# EAGLE design ASD2431 (EAGLE 6.3)
DATABASE: ./../../../../../Components/TinyCircuits_Part_Database.txt
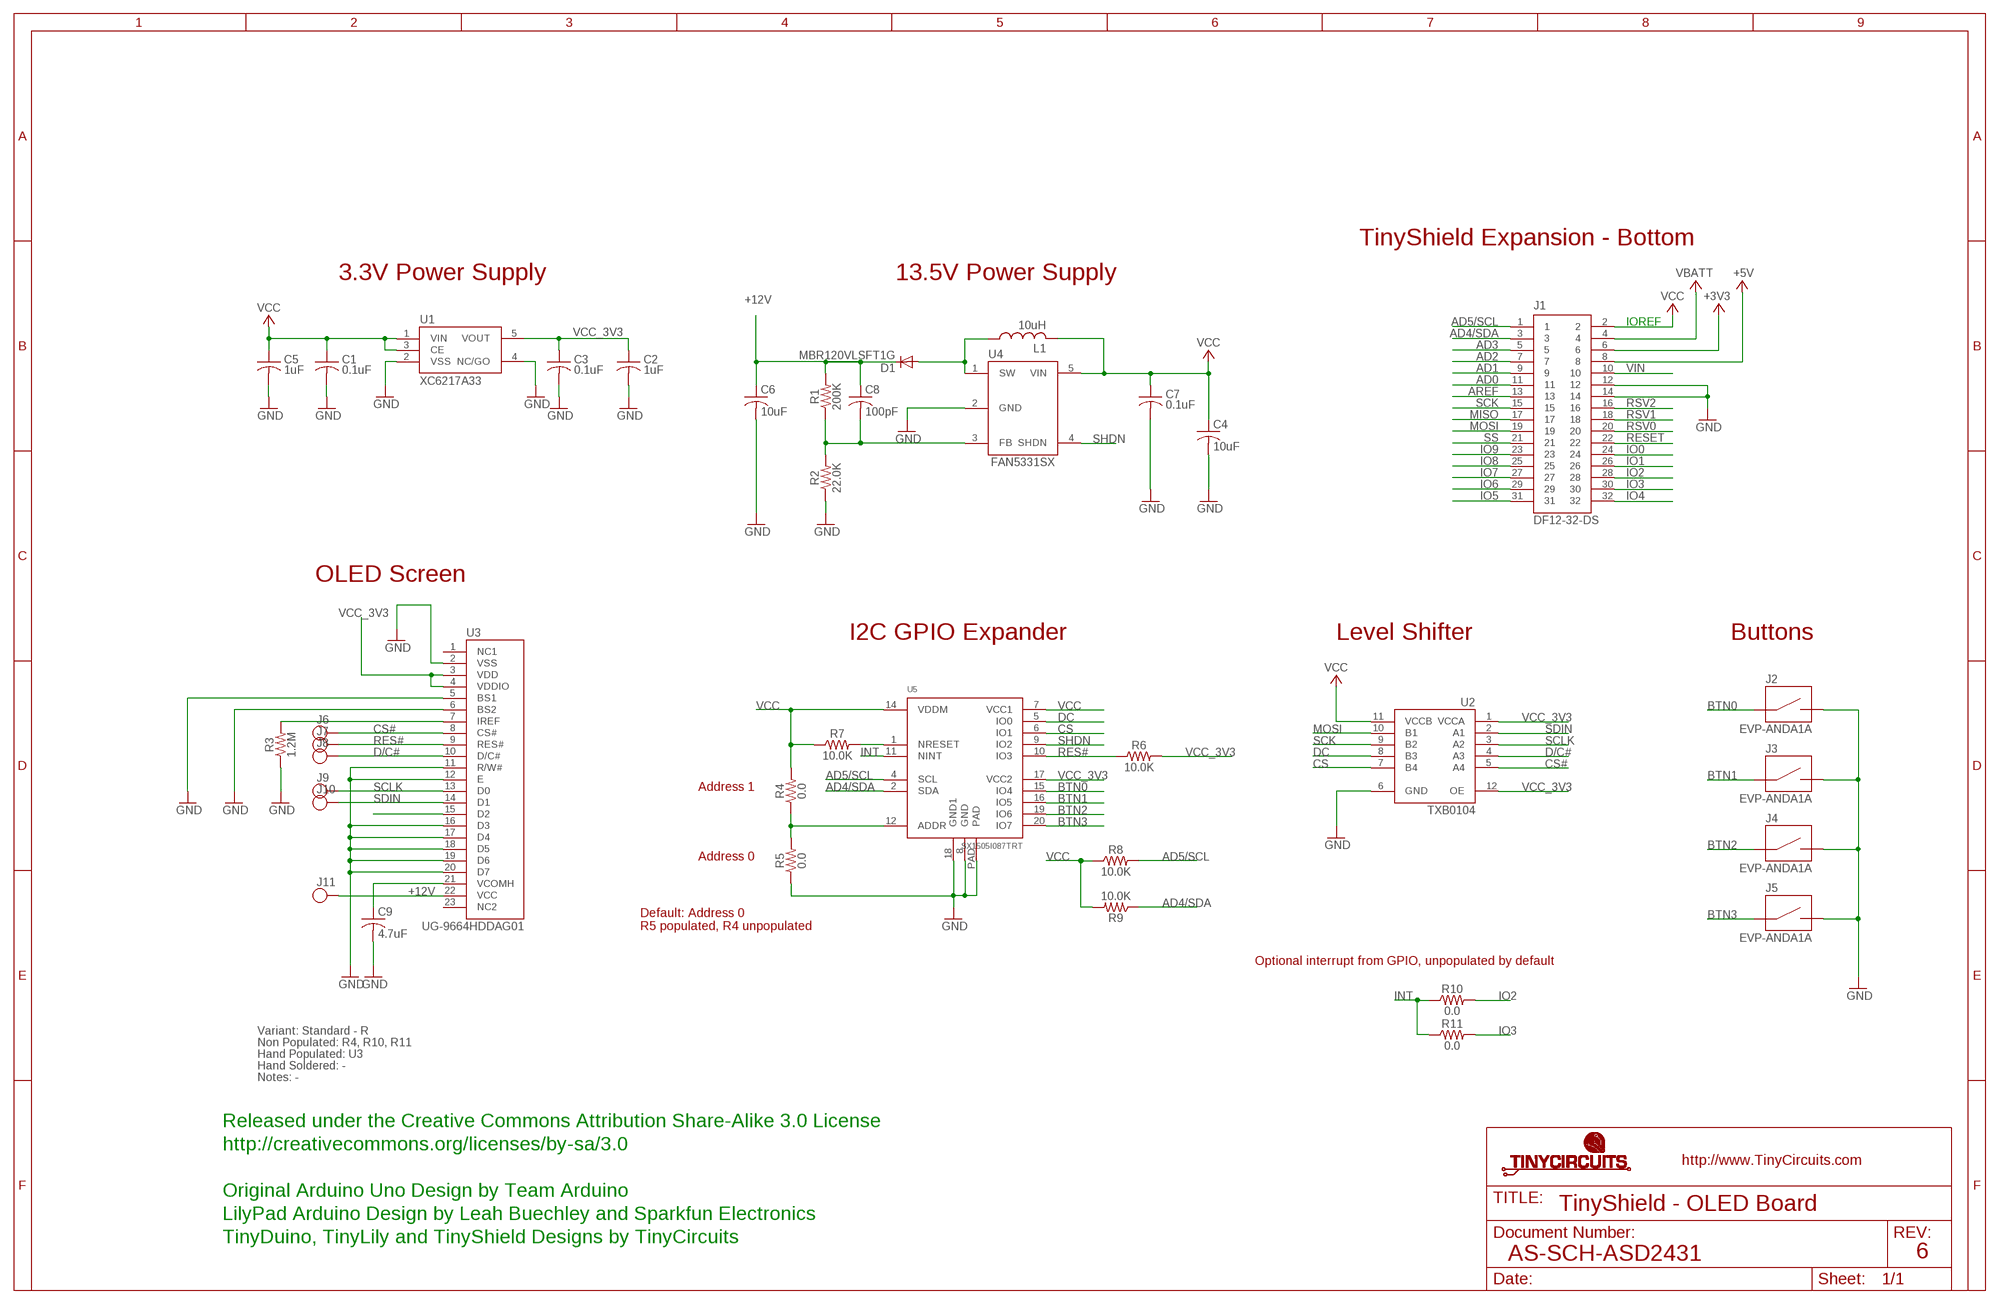
[diagram p0: schematic, sheet 1]

## Parts
C1  0.1uF  AS-ITM-00008  [C0402]
C2  1uF  AS-ITM-00105  [C0402]
C3  0.1uF  AS-ITM-00008  [C0402]
C4  10uF  AS-ITM-00045  [C0805]
C5  1uF  AS-ITM-00105  [C0402]
C6  10uF  AS-ITM-00045  [C0805]
C7  0.1uF  AS-ITM-00008  [C0402]
C8  100pF  AS-ITM-00148  [0402]
C9  4.7uF  AS-ITM-00232  [1206_CAP_TANT]
D1  MBR120VLSFT1G  AS-ITM-00111  [SOD-123FL]
J1  DF12-32-DS  AS-ITM-00012  [DF12-32-DS]
J2  EVP-ANDA1A  AS-ITM-00236  [PTS840GKP]
J3  EVP-ANDA1A  AS-ITM-00236  [PTS840GKP]
J4  EVP-ANDA1A  AS-ITM-00236  [PTS840GKP]
J5  EVP-ANDA1A  AS-ITM-00236  [PTS840GKP]
J6  TEST_POINT  [TEST_POINT_1MM]
J7  TEST_POINT  [TEST_POINT_1MM]
J8  TEST_POINT  [TEST_POINT_1MM]
J9  TEST_POINT  [TEST_POINT_1MM]
J10  TEST_POINT  [TEST_POINT_1MM]
J11  TEST_POINT  [TEST_POINT_1MM]
L1  10uH  AS-ITM-00165  [R0805]
R1  200K  AS-ITM-00178  [0402]
R2  22.0K  AS-ITM-00147  [0402]
R3  1.2M  AS-ITM-00280  [0402]
R4  0.0  AS-ITM-00076  [0402]
R5  0.0  AS-ITM-00076  [0402]
R6  10.0K  AS-ITM-00032  [0402]
R7  10.0K  AS-ITM-00032  [0402]
R8  10.0K  AS-ITM-00032  [0402]
R9  10.0K  AS-ITM-00032  [0402]
R10  0.0  AS-ITM-00076  [0402]
R11  0.0  AS-ITM-00076  [0402]
U1  XC6217A33  AS-ITM-00249  [SOT-25]
U2  TXB0104  AS-ITM-00048  [UQFN-12]
U3  UG-9664HDDAG01  AS-ITM-00158  [OLED_DISPLAY]
U4  FAN5331SX  AS-ITM-00163  [SOT-23]
U5  SX1505I087TRT  AS-ITM-00203  [QFN-UT20]

## Nets
+3V3: J1.6
+5V: J1.8
+12V: C6.1 C8.1 D1.C J11.P$1 R1.2 U3.22(VCC)
AD0: J1.11
AD1: J1.9
AD2: J1.7
AD3: J1.5
AD4/SDA: J1.3 R9.1 U5.2(SDA)
AD5/SCL: J1.1 R8.2 U5.4(SCL)
AREF: J1.13
BTN0: J2.1 J2.2 U5.15(IO4)
BTN1: J3.1 J3.2 U5.16(IO5)
BTN2: J4.1 J4.2 U5.19(IO6)
BTN3: J5.1 J5.2 U5.20(IO7)
CS: U2.7(B4) U5.6(IO1)
CS#: J6.P$1 U2.5(A4) U3.8(CS#)
D/C#: J8.P$1 U2.4(A3) U3.10(D/C#)
DC: U2.8(B3) U5.5(IO0)
GND: C1.2 C2.2 C3.2 C4.2 C5.2 C6.2 C7.2 C9.2 J1.12 J1.14 J2.3 J2.4 J3.3 J3.4 J4.3 J4.4 J5.3 J5.4 R2.1 R3.1 R5.1 U1.2(VSS) U1.4(NC/GO) U2.6(GND) U3.2(VSS) U3.5(BS1) U3.6(BS2) U3.11(R/W#) U3.12(E) U3.16(D3) U3.17(D4) U3.18(D5) U3.19(D6) U3.20(D7) U4.2(GND) U5.8(GND) U5.18(GND1) U5.PAD
INT: R10.1 R11.1 U5.11(NINT)
IO0: J1.24
IO1: J1.26
IO2: J1.28 R10.2
IO3: J1.30 R11.2
IO4: J1.32
IO5: J1.31
IO6: J1.29
IO7: J1.27
IO8: J1.25
IO9: J1.23
MISO: J1.17
MOSI: J1.19 U2.10(B1)
N$1: R7.2 U5.1(NRESET)
N$2: D1.A L1.1 U4.1(SW)
N$3: C8.2 R1.1 R2.2 U4.3(FB)
N$6: R3.2 U3.7(IREF)
N$7: C9.1 U3.21(VCOMH)
N$13: R4.1 R5.2 U5.12(ADDR)
N$15: U3.15(D2)
RES#: J7.P$1 R6.1 U3.9(RES#) U5.10(IO3)
RESET: J1.22
RSV0: J1.20
RSV1: J1.18
RSV2: J1.16
SCK: J1.15 U2.9(B2)
SCLK: J9.P$1 U2.3(A2) U3.13(D0)
SDIN: J10.P$1 U2.2(A1) U3.14(D1)
SHDN: U4.4(SHDN) U5.9(IO2)
SS: J1.21
VBATT: J1.4
VCC: C1.1 C4.1 C5.1 C7.1 J1.2 L1.2 R4.2 R7.1 R8.1 R9.2 U1.1(VIN) U1.3(CE) U2.11(VCCB) U4.5(VIN) U5.7(VCC1) U5.14(VDDM)
VCC_3V3: C2.1 C3.1 R6.2 U1.5(VOUT) U2.1(VCCA) U2.12(OE) U3.3(VDD) U3.4(VDDIO) U5.17(VCC2)
VIN: J1.10
Unconnected: U3.1(NC1) U3.23(NC2)

## Notes on the sheet
- TinyShield Expansion - Bottom
- 3.3V Power Supply | 13.5V Power Supply
- IOREF
- OLED Screen
- I2C GPIO Expander | Level Shifter | Buttons
- Address 1
- Address 0
- Default: Address 0
  R5 populated, R4 unpopulated
- Optional interrupt from GPIO, unpopulated by default
- Variant: Standard - R
- Non Populated: R4, R10, R11
- Hand Populated: U3
- Hand Soldered: -
- Notes: -
- Released under the Creative Commons Attribution Share-Alike 3.0 License
- http://creativecommons.org/licenses/by-sa/3.0
- Original Arduino Uno Design by Team Arduino
- TinyShield - OLED Board
- LilyPad Arduino Design by Leah Buechley and Sparkfun Electronics
- TinyDuino, TinyLily and TinyShield Designs by TinyCircuits
- AS-SCH-ASD2431 | 6

## Library data of the parts
C1 C3 C7 = tinycircuits:AS-ITM-00008: CAP CER 0.1UF 16V 10% X5R 0402; PARTNO: AS-ITM-00008
C2 C5 = tinycircuits:AS-ITM-00105: CAP CER 1UF 6.3V 10% X5R 0402; PARTNO: AS-ITM-00105
C4 C6 = tinycircuits:AS-ITM-00045: CAP CER 16UF 16V 20% X5R 0805; PARTNO: AS-ITM-00045
C8 = tinycircuits:AS-ITM-00148: CAP CER 100PF 50V 5% NPO 0402; PARTNO: AS-ITM-00148
C9 = tinycircuits:AS-ITM-00232: CAP TANT 4.7UF 20V 20% 1206; PARTNO: AS-ITM-00232; PNPROTATION: 180; VALUE: F931D475MAA
D1 = tinycircuits:AS-ITM-00111: DIODE SCHOTTKY 20V 1A SOD123L; PARTNO: AS-ITM-00111; PNPROTATION: 0
J1 = tinycircuits:AS-ITM-00012: CONN RECEPT 32POS 3MM SMD 0.5MM; PARTNO: AS-ITM-00012
J2-J5 = tinycircuits:AS-ITM-00236: SWITCH TACTILE SPST-NO 0.05A 12V; PARTNO: AS-ITM-00236; PNPROTATION: 90; VALUE: PTS840 GKP
J6-J11 = tinycircuits:TEST_POINT: Test point, no drill
L1 = tinycircuits:AS-ITM-00165: INDUCTOR MULTILAYER 10UH 0805; PARTNO: AS-ITM-00165
R1 = tinycircuits:AS-ITM-00178: RES 200K OHM 116W 1% 0402 SMD; PARTNO: AS-ITM-00178
R2 = tinycircuits:AS-ITM-00147: RES 22K OHM 1/16W 5% 0402 SMD; PARTNO: AS-ITM-00147; VALUE: 22K
R3 = tinycircuits:AS-ITM-00280: RES SMD 1.2M OHM 1% 1/16W 0402; PARTNO: AS-ITM-00280
R4 R5 R10 R11 = tinycircuits:AS-ITM-00076: RES 0.0 OHM 1/16W 1% 0402 SMD; PARTNO: AS-ITM-00076
R6-R9 = tinycircuits:AS-ITM-00032: RES 10.0K OHM 1/16W 1% 0402 SMD; PARTNO: AS-ITM-00032
U1 = tinycircuits:AS-ITM-00249: IC REG LDO 3.3V 0.2A SOT25; PARTNO: AS-ITM-00249; PNPROTATION: 270
U2 = tinycircuits:AS-ITM-00048: IC VOLT-LEVEL TRANSLATOR 12UQFN; PARTNO: AS-ITM-00048; PNPROTATION: 0
U3 = tinycircuits:AS-ITM-00158: 0.96" OLED Display; PARTNO: AS-ITM-00158
U4 = tinycircuits:AS-ITM-00163: IC LED DRVR WHITE BCKLGT SOT23-5; PARTNO: AS-ITM-00163
U5 = tinycircuits:AS-ITM-00203: IC GPIO EXP I2C 8CH 20UTQFN; PARTNO: AS-ITM-00203

## Board
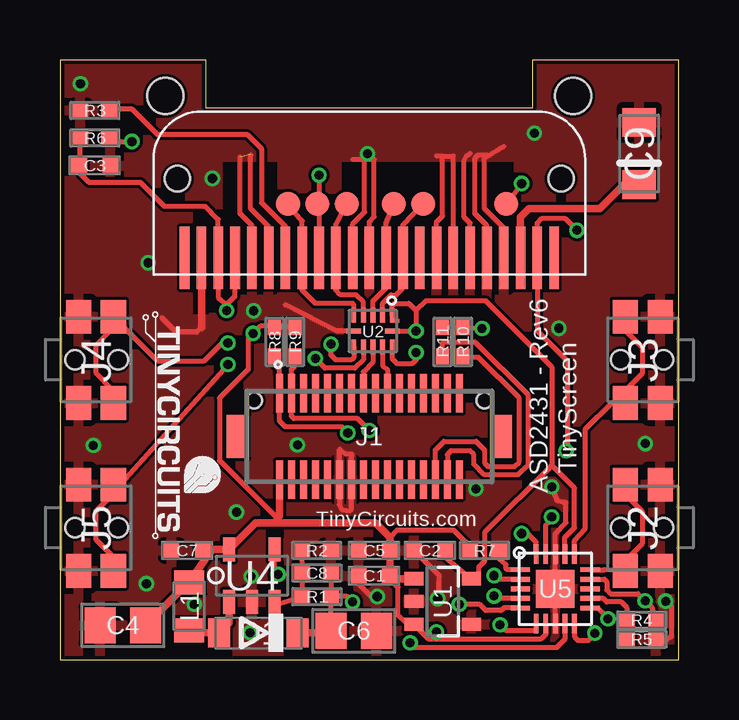
[diagram p1: board, top side]
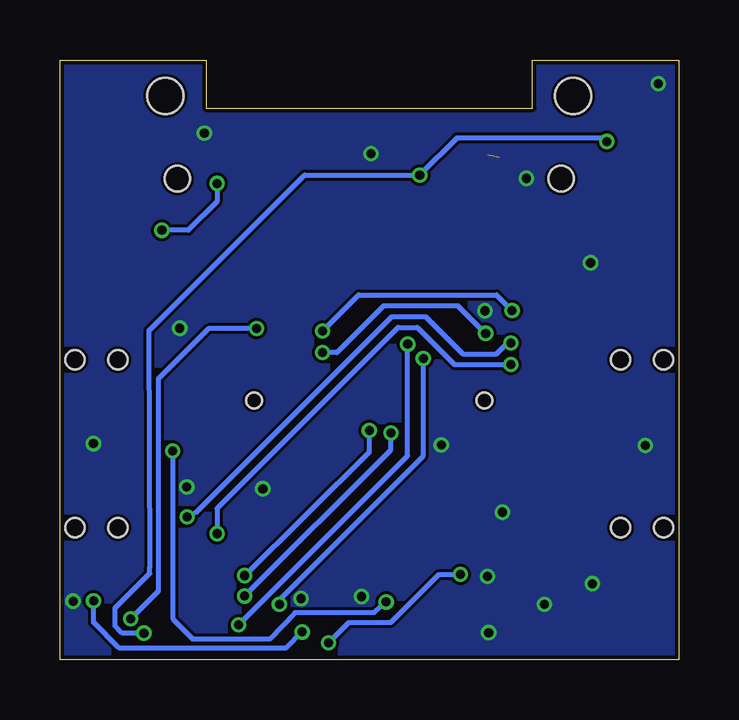
[diagram p2: board, bottom side, seen from below]

Size 25.8 x 25 mm. Coordinates in mm from the lower left corner, seen from the top.
Outline: 25.8,25 19.7,25 19.7,23 6.1,23 6.1,25 0,25 0,0 25.8,0 25.8,25
Copper layers (1*16): Top 0.035mm / dielectric 1.5mm / Bottom 0.035mm
Design rules "default *": minimum track width 5mil, minimum drill 12mil, track to track 5mil, track to pad 5mil, pad to pad 5mil, via to via 6mil, smd to smd 5mil, copper to edge 6mil, drill to drill 8mil, minimum pad ring 10mil, minimum via ring 5mil, stop-mask expansion 4mil, vias tented up to drill 25mil, thermal gap 10mil
Holes 1.5 mm at 21.4,23.5 4.4,23.5
tRestrict: area 5.6,14.4 to 6.2,19.1; area 11.8,15.5 to 18.9,20.8; area 7.6,15.4 to 9.1,20.8; area 7.6,15.4 to 9.1,20.7; area 6.8,18.2 to 9.1,20.8; 1 lines

### Footprints (pad centres in the part's own frame; a part is rotated, then mirrored left to right if it is on the bottom)
C0402 = smd 0.65 x 0.6: 1 -0.65,0; 2 0.65,0
C0805 = smd 1.3 x 1.5: 1 -0.95,0; 2 0.95,0
0402 = smd 0.65 x 0.55: 1 -0.6,0; 2 0.6,0
1206_CAP_TANT = smd 1.2 x 1.4: 1 -1.3,0; 2 1.3,0
SOD-123FL = smd 0.914 x 1.219: A 1.638,0; C -1.638,0
DF12-32-DS = smd 0.3 x 1.6: 1 -3.75,1.8; 2 -3.75,-1.8; 3 -3.25,1.8; 4 -3.25,-1.8; 5 -2.75,1.8; 6 -2.75,-1.8; 7 -2.25,1.8; 8 -2.25,-1.8; 9 -1.75,1.8; 10 -1.75,-1.8; 11 -1.25,1.8; 12 -1.25,-1.8; 13 -0.75,1.8; 14 -0.75,-1.8; 15 -0.25,1.8; 16 -0.25,-1.8; 17 0.25,1.8; 18 0.25,-1.8; 19 0.75,1.8; 20 0.75,-1.8; 21 1.25,1.8; 22 1.25,-1.8; 23 1.75,1.8; 24 1.75,-1.8; 25 2.25,1.8; 26 2.25,-1.8; 27 2.75,1.8; 28 2.75,-1.8; 29 3.25,1.8; 30 3.25,-1.8; 31 3.75,1.8; 32 3.75,-1.8 | smd 0.9 x 1.8: F1 -5.5,0; F2 5.5,0 | hole 0.65: -4.8,1.5; 4.8,1.5
PTS840GKP = smd 1.4 x 1.05: 1 -1.8,0.725; 2 1.8,0.725; 3 -1.8,-0.725; 4 1.8,-0.725 | hole 0.8: 0,0.925; 0,-0.875
TEST_POINT_1MM = smd 1 x 1: P$1 0,0
R0805 = smd 1 x 1.25: 1 -1,0; 2 1,0
SOT-25 = smd 0.55 x 0.8: 1 -0.95,-1.2; 2 0,-1.2; 3 0.95,-1.2; 4 0.95,1.2; 5 -0.95,1.2
UQFN-12 = smd 0.2 x 0.6: 1 -0.8,-0.65; 2 -0.4,-0.65; 3 0,-0.65; 4 0.4,-0.65; 5 0.8,-0.65; 7 0.8,0.65; 8 0.4,0.65; 9 0,0.65; 10 -0.4,0.65; 11 -0.8,0.65 | smd 0.6 x 0.2: 6 0.8,0; 12 -0.8,0
OLED_DISPLAY = smd 0.4 x 2.6: 1 -7.7,0.2; 2 -7,0.2; 3 -6.3,0.2; 4 -5.6,0.2; 5 -4.9,0.2; 6 -4.2,0.2; 7 -3.5,0.2; 8 -2.8,0.2; 9 -2.1,0.2; 10 -1.4,0.2; 11 -0.7,0.2; 12 0,0.2; 13 0.7,0.2; 14 1.4,0.2; 15 2.1,0.2; 16 2.8,0.2; 17 3.5,0.2; 18 4.2,0.2; 19 4.9,0.2; 20 5.6,0.2; 21 6.3,0.2; 22 7,0.2; 23 7.7,0.2 | hole 1.05: 8,3.5; -8,3.5
SOT-23 = smd 0.5 x 1: 1 -0.95,-1.1; 2 0,-1.1; 3 0.95,-1.1; 4 0.95,1.1; 5 -0.95,1.1
QFN-UT20 = smd 0.8 x 0.2: 1 -1.45,0.8; 2 -1.45,0.4; 3 -1.45,0; 4 -1.45,-0.4; 5 -1.45,-0.8; 11 1.45,-0.8; 12 1.45,-0.4; 13 1.45,0; 14 1.45,0.4; 15 1.45,0.8 | smd 0.2 x 0.8: 6 -0.8,-1.45; 7 -0.4,-1.45; 8 0,-1.45; 9 0.4,-1.45; 10 0.8,-1.45; 16 0.8,1.45; 17 0.4,1.45; 18 0,1.45; 19 -0.4,1.45; 20 -0.8,1.45 | smd 1.6 x 1.6: PAD 0,0

### Placement (x,y rotation side)
C1  13.1,3.5 180 top
C2  15.42,4.55 180 top
C3  1.45,20.6 0 top
C4  2.62,1.43 180 top
C5  13.1,4.55 180 top
C6  12.25,1.2 0 top
C7  5.3,4.55 180 top
C8  10.71,3.61 180 top
C9  24.15,21.1 90 top
D1  8.27,1.11 180 top
J1  12.9,9.3 0 top
J2  24.3,5.5 90 top
J3  24.3,12.5 90 top
J4  1.5,12.5 270 top
J5  1.5,5.5 270 top
J6  9.51,19 0 top
J7  10.73,19 270 top
J8  11.95,19 270 top
J9  13.92,19 270 top
J10  15.14,19 270 top
J11  18.61,19 0 top
L1  5.39,2.23 90 top
R1  10.71,2.63 0 top
R2  10.7,4.55 180 top
R3  1.45,22.9 0 top
R4  24.25,1.65 0 top
R5  24.25,0.85 180 top
R6  1.45,21.75 180 top
R7  17.7,4.55 0 top
R8  8.95,13.25 270 top
R9  9.8,13.25 90 top
R10  16.8,13.25 270 top
R11  15.95,13.25 270 top
U1  15.96,2.42 270 top
U2  13.05,13.7 180 top
U3  12.9,16.55 0 top
U4  8,3.5 0 top
U5  20.65,2.95 0 top
U$1  [DOCFIELD-TINYCIRCUITS-PCB]  38.91,-10 0 top  (outside the outline)

### Tracks (layer width: path | path; a pad name or v marks a point on that pad's centre or on a via)
+12V  (via drill 0.38)
  Top 0.203: C8.1 R1.2 | C6.1 11.3,2.62 R1.2 | v12.2,2.4 11.97,2.63 R1.2 | v21.1,8.7 21.15,8.75 21.15,12.45 19.9,13.7 U3.22 19.9,18.2 20.1,18.4 21.05,18.4 v21.55,17.9 | v19.25,19.85 J11.P$1
  Top 0.305: D1.C 11.21,1.11 C6.1
  Bottom 0.203: v12.2,2.4 12.7,1.95 16,1.95 17.05,0.85 20.25,0.85 21.1,1.7 v21.1,8.7 | 21.5,17.9 v21.55,17.9 20.45,17.9 19.25,19.1 v19.25,19.85
AD4/SDA  (via drill 0.38)
  Top 0.203: U5.2 18.25,3.35 v18.1,3.5 | v12.9,9.55 12.4,10.05 9.75,10.05 9.65,10.15 J1.3 9.65,12.1 9.8,12.25 R9.1
  Bottom 0.203: v18.1,3.5 12.9,8.65 v12.9,9.55
AD5/SCL  (via drill 0.38)
  Top 0.203: U5.4 18.2,2.55 v18.1,2.65 | v12,9.45 11.75,9.7 9.4,9.7 9.15,9.95 J1.1 9.15,12.1 8.95,12.3 R8.2
  Bottom 0.203: v18.1,2.65 12,8.75 v12,9.45
BTN0
  Top 0.203: J2.1 23.48,3.76 | U5.15 22.72,3.75 23.48,3.76 | 23.48,3.76 23.16,3.71 24.3,4.85 24.3,6.15 23.8,6.65 23.8,7.07 J2.2
BTN1
  Top 0.203: J3.1 23,10.71 | U5.16 21.45,4.95 21.9,5.45 21.9,9.61 23,10.71 | 23,10.71 23.06,10.71 24.3,11.95 24.3,13 23.58,13.73 J3.2
BTN2  (via drill 0.38)
  Top 0.203: U5.19 20.25,5.6 v20.5,5.95 | J4.2 2.22,11.23 1.5,11.95 1.5,13.1 2.1,13.7 2.1,14.18 J4.1 4.07,12.45 6,12.45 6.75,13.2 v7,13.2
  Bottom 0.203: v20.5,5.95 20.1,6.15 11.95,14.3 10.55,14.3 9,12.75 7.6,12.75 7.15,13.2 v7,13.2
BTN3  (via drill 0.38)
  Top 0.203: U5.20 19.85,4.9 19.5,5.25 v19.25,5.25 | J5.2 2.22,4.28 1.5,5 1.5,6.2 2.05,6.75 2.05,7.12 J5.1 2.5,7.3 v7,12.3
  Bottom 0.203: v19.25,5.25 19.25,6.3 11.7,13.85 10.9,13.85 9.35,12.3 v7,12.3
CS  (via drill 0.38)
  Top 0.203: U2.7 12.25,12.6 12.15,12.5 11.5,12.5 11.3,12.7 v11.3,13.15 | U5.6 19.85,1.2 18.6,1.2 v18.35,1.45
  Bottom 0.203: v11.3,13.15 11.3,8.5 v18.35,1.45
CS#
  Top 0.203: U2.5 12.25,14.8 12.2,14.85 10.65,14.85 10.1,15.4 U3.8 10.1,18.29 J6.P$1
D/C#
  Top 0.203: U2.4 12.65,14.9 12.35,15.2 11.7,15.2 11.5,15.4 U3.10 11.5,18.15 J8.P$1
DC  (via drill 0.38)
  Top 0.203: U2.8 12.65,12.5 12.3,12.15 11.05,12.15 v10.65,12.55 | U5.5 18.5,2.15 18.4,2.05 17.75,2.05 17.5,2.3 v16.65,2.3
  Bottom 0.203: v16.65,2.3 16.65,2.5 10.65,8.5 v10.65,12.55
GND  (via drill 0.38)  (1 unrouted)
  Top 0.203: 11.67,7.52 11.67,8.77 11.67,8.72 11.92,8.57 12.17,8.56 12.12,8.11 | 11.67,7.52 J1.12 11.65,6.45 11.75,6.25 12.1,6.2 12.15,6.25 J1.14 | 11.67,7.52 11.67,7.5 | U2.6 11.55,13.7 9.4,14.8 | v20.51,7.2 20.76,6.6 21,6.55 21.1,6.55 21.1,5.7 20.65,5.25 U5.18 U5.PAD U5.8 | R5.1 25.3,0.85 25.5,0.95 25.5,2.2 v25.25,2.43 | v13.23,2.63 13.21,2.65 12.95,2.65 12.45,3.15 C1.2 | C2.2 15.8,3.52 v15.75,2.54 | 5.9,13.85 5.7,13.65 4.85,13.65 4.25,14.25 | U3.20 18.5,18 17.7,18.8 17.7,20.9 17.75,20.95 18.5,21.4 | U3.19 17.8,18.1 17.3,18.6 17.3,20.9 17.45,21.05 17.8,21.05 | U3.18 17.1,18.2 16.85,18.45 16.85,20.8 16.95,21 17.1,21.1 | U3.17 16.4,21 15.95,21 | U3.16 15.7,18.25 15.95,18.5 15.95,21 | 15.95,21 15.7,21 | U3.12 12.9,18.25 13.1,18.45 13.1,20.85 12.9,20.85 | U3.11 12.2,18.15 12.7,18.65 12.7,20.85 | 12.7,20.85 12.2,20.85 | U3.6 8.7,18.05 7.95,18.8 7.95,21.05 | U3.5 8,18.1 7.5,18.6 7.5,20.95 | 12.9,20.85 12.7,20.85 | 12.9,20.85 12.9,21.02 v12.83,21.09
  Top 0.305: U3.2 5.9,13.85
  other vias: 7.36,6.14 5.6,2.3 9.9,8.94 7.97,3.47 3.68,16.54 1.39,8.92 17.34,7.12 24.4,9 20.8,13.81 3.6,3.16 6.35,20.06 19.78,21.94 7.92,1.12 8.08,14.54 0.85,24.01
  pour Top: 25.8,25 19.9,25 19.9,23 5.9,23 5.9,25 0,25 0,0 25.8,0
  pour Bottom: 25.8,25 19.7,25 19.7,23 6.1,23 6.1,25 0,25 0,0 25.8,0
INT  (via drill 0.38)
  Top 0.203: U5.11 22.4,2.15 v22.85,1.7 | v17.6,13.8 16.85,13.8 R10.1 R11.1
  Bottom 0.203: v17.6,13.8 19.6,13.8 21.7,11.7 21.7,2.85 v22.85,1.7
IO2
  Top 0.203: J1.28 15.65,8.75 16,9.1 17.35,9.1 17.7,8.75 17.7,8.2 17.85,8.05 18.95,8.05 19.15,8.25 19.15,10.9 17.45,12.6 16.85,12.6 R10.2
IO3
  Top 0.203: R11.2 15.95,13.2 16,13.25 17.3,13.25 19.5,11.05 19.5,8.1 19.1,7.7 17.7,7.7 17.25,8.15 17.25,8.55 17.1,8.7 16.3,8.7 16.15,8.55 J1.30
MOSI
  Top 0.203: U2.10 13.45,12.25 13.65,12.1 J1.19
N$1
  Top 0.203: U5.1 18.65,3.75 18.6,3.8 18.6,3.95 18.3,4.2 R7.2
N$2
  Top 0.305: L1.1 6.57,1.05 D1.A 7.05,1.54 U4.1
N$3
  Top 0.203: U4.3 8.97,2.28 R1.1 C8.2 R2.2
N$6
  Top 0.203: R3.2 2.35,22.95 3,22.95 4.05,21.9 7.8,21.9 8.4,21.3 8.4,19.05 9.4,18.05 U3.7
N$7
  Top 0.305: U3.21 19.2,18.45 19.55,18.8 22.5,18.8 23.5,19.8 C9.1
N$13
  Top 0.203: R5.2 R4.1 23.65,2.15 23.4,2.4 22.8,2.4 22.65,2.55 U5.12
RES#  (via drill 0.38)
  Top 0.203: 10.8,18.97 U3.9 | v3,21.6 2.2,21.6 R6.1 | U5.10 21.45,0.95 21.6,0.8 22.05,0.8 v22.3,1.1 | v10.8,20.2 10.8,18.97 | 10.8,18.97 J7.P$1
  Bottom 0.203: v3,21.6 3.1,21.75 9.25,21.75 v10.8,20.2 15.6,20.2 22.1,13.7 22.06,3.85 22.06,3.59 23.5,2.15 23.5,1.4 23.2,1.1 v22.3,1.1
SCK
  Top 0.203: U2.9 13.05,12.4 12.65,12 J1.15
SCLK
  Top 0.203: U2.3 13.05,14.95 13.6,15.5 U3.13 13.6,18.18 J9.P$1
SDIN
  Top 0.203: U2.2 13.45,14.85 13.8,15.2 14,15.2 14.3,15.5 U3.14 14.3,18.11 J10.P$1
SHDN  (via drill 0.38)
  Top 0.203: 8.95,4.95 U4.4 8.95,3.7 v9.1,3.55 | U5.9 21.05,0.85 20.7,0.5 14.8,0.5 v14.6,0.7
  Bottom 0.203: v14.6,0.7 13.75,1.55 12,1.55 10,3.55 v9.1,3.55
VCC  (via drill 0.38)
  Top 0.203: U1.3 14.74,1.55 | U1.1 14.8,3.43 | U1.3 14.43,1.52 14.1,1.85 14.1,3.01 13.71,3.42 13.81,3.42 C1.1 | U2.11 13.85,12.55 14.05,12.35 14.7,12.35 14.85,12.5 v14.85,12.8 | U5.7 20.25,1.05 20.05,0.85 16,0.85 | 16,0.85 15.38,0.85 U1.3 | U5.14 22.7,3.35 22.8,3.25 22.8,2.9 22.95,2.75 24.1,2.75 v24.4,2.45 24.7,2.15 R4.2 | v15.7,1.15 16,0.85 | R7.1 17.15,4.65 16.4,5.4 14.05,5.4 13.75,5.1 | R9.2 R8.1 | 9.05,5.9 6.65,8.3 6.65,10.9 7.85,12.1 7.85,13.4 v8.05,13.6 8.35,13.9 9.75,13.9
  Top 0.254: R9.2 9.75,13.9
  Top 0.305: J1.2 9.15,6 9.05,5.9 9.05,5.7 | 9.05,5.7 8.15,5.7 U4.5 6.34,4.6 | 6.34,4.6 L1.2 5.34,3.2 C4.1 | 6.34,4.6 C7.1 | 9.05,5.7 13.15,5.7 13.75,5.1 C5.1 C1.1 13.88,3.37 U1.1
  Bottom 0.203: v15.7,1.15 16.35,0.5 23.35,0.5 24.4,1.55 v24.4,2.45 | v8.05,13.6 9.2,14.75 12.3,14.75 14.25,12.8 v14.85,12.8
VCC_3V3  (via drill 0.38)
  Top 0.203: 6.95,14.8 6.6,15.1 U3.3 6.6,18.35 6.05,18.9 4.35,18.9 3.35,19.9 1.2,19.9 0.87,20.23 C3.1 0.85,20.65 R6.2 | U3.4 7.3,15.15 6.95,14.8 | 17.15,3.42 U1.5 | U2.1 13.85,14.75 13.95,14.85 14.55,14.85 14.85,14.55 | U2.12 v14.85,13.7 14.85,14.55 | U1.5 17.19,3.4 | 20.5,8.1 20.5,12.2 17.75,14.95 15.25,14.95 14.85,14.55 | 6.95,14.8 v6.95,14.55 | U5.17 21.05,5.1 21.45,5.5 21.45,7.15 20.5,8.1 | U1.5 17.45,3.48 17.45,3.85 17.7,4.1 17.7,5.3 20.5,8.1 | C2.1 16.07,4.26 U1.5
  Bottom 0.203: v14.85,13.7 13.35,15.2 7.6,15.2 v6.95,14.55

### Text on the board
tPlace: ASD2431 - Rev6 | TinyScreen | TinyCircuits.com
Document: FABRICATION DRAWING | NOTES: | 1. PRINTED CIRCUIT BOARD MADE FROM NEMA GRADE FR-4 EPOXY LAMINATE | WITH 1 OUNCE COPPER PLATING AND .024 THICKNESS. | 2. ALL DIMENSIONS ARE GIVEN IN INCHES. | 3. CIRCUIT PATHS ARE FOR REFERENCE ONLY. | 4. HOLE SIZES SHOWN ARE FINISHED DIAMETERS AFTER PLATING. | 5. BOARD PLATED USING REFLOW OR SIMILAR METHOD. | 6. BOARD TO HAVE BLUE SOLDER MASK ON PLATED SURFACES USING WET FILM | 7. SILKSCREEN BOARD USING WHITE INK. | SR100 OR SR1010 EPOXY. EQUIVALENT WET OR DRY FILM MAY BE USED. | 8. THE FOLLOWING INFORMATION APPLIES TO THIS BOARD: | * 2 COPPER LAYERS | * .024 BOARD THICKNESS | * REQUIRES TOP SIDE SILKSCREEN | Released under the Creative Commons Attribution Share-Alike 3.0 License | http://creativecommons.org/licenses/by-sa/3.0 | Original Arduino Uno Design by Team Arduino | LilyPad Arduino Design by Leah Buechley and Sparkfun Electronics | TinyDuino, TinyLily and TinyShield Designs by TinyCircuits | TinyShield - OLED Board | AS-PCB-ASD2431 | 6